# Altium project NB2DSK01.PRJPCB (part 2 of 2)

## Sheet FPGA_PRGSETUP.SchDoc: XC3S1500-4FG676C Configuration
size A4; Organization: Altium Limited.; Address1: Level 3, 12a Rodborough Rd; Address2: Frenchs Forest 2086; Address3: NSW; Address4: AUSTRALIA; DocumentNumber: 13; Revision: 6; SheetNumber: 13; SheetTotal: 64; PageSetup: Record=PageOptions|CenterHorizontal=True|CenterVertical=True|PrintScale=0.97|XCorrection=1.00|YCorrection=1.00|PrintKind=0|BorderSize=5000000|LeftOffset=0|BottomOffset=0|Orientation=2|PaperLength=1000|PaperWidth=1000|Scale=100|PaperSource=7|PrintQuality=-4|MediaType=1|DitherType=10|PaperKind=A4 (210 x 297mm)|PrintScaleMode=1
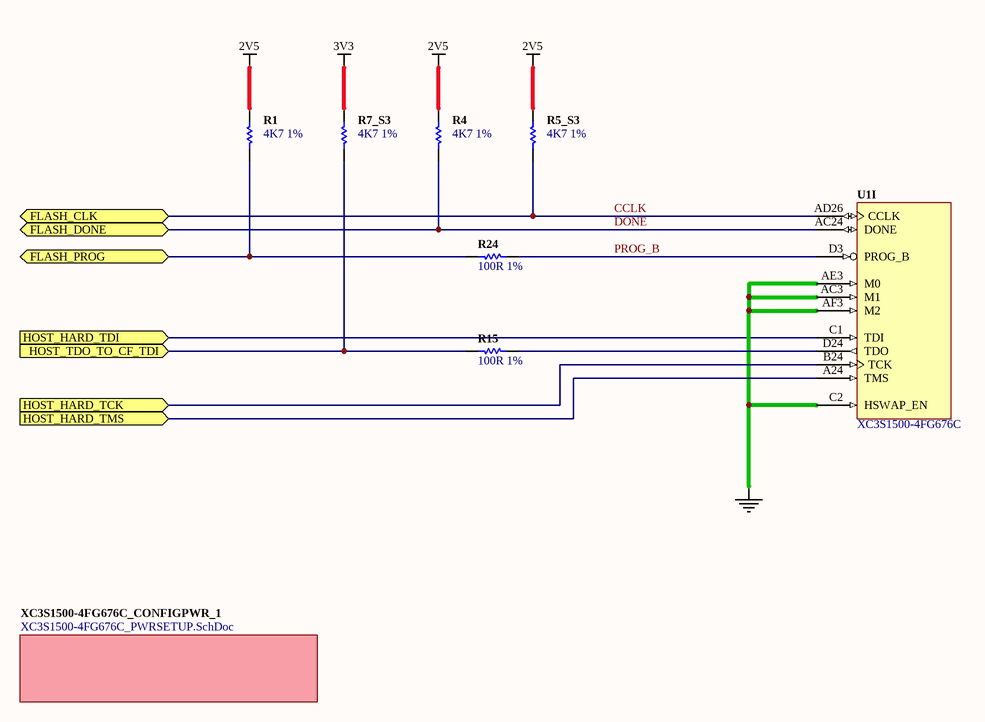
[diagram p6: FPGA_PRGSETUP.SchDoc]

### Parts
(Parts that share a designator on the sheet are numbered #1, #2 ... from top to bottom, then left to right.)
R1  4K7 1%  [RESC1005-STAR]
R4  4K7 1%  [RESC1005-STAR]
R5_S3  4K7 1%  [RESC1005-STAR]
R7_S3  4K7 1%  [RESC1005-STAR]
R15  100R 1%  [RESC1005-STAR]
R24  100R 1%  [RESC1005-STAR]
U1#1  XC3S1500-4FG676C  [BGA100P26X26-676]  (part I of 12)

### Sub-sheets
XC3S1500-4FG676C_CONFIGPWR_1 = XC3S1500-4FG676C_PWRSETUP.SchDoc: no entries

### Ports
FLASH_CLK (bidir), FLASH_DONE (bidir), FLASH_PROG (bidir), HOST_HARD_TCK (in), HOST_HARD_TDI (in), HOST_HARD_TMS (in), HOST_TDO_TO_CF_TDI (in)

### Nets
2V5: R1.1 R4.1 R5_S3.1
3V3: R7_S3.1
GND: U1#1.AC3(M1) U1#1.AE3(M0) U1#1.AF3(M2) U1#1.C2(HSWAP_EN)
CCLK: R5_S3.2 U1#1.AD26(CCLK) ; port FLASH_CLK
DONE: R4.2 U1#1.AC24(DONE) ; port FLASH_DONE
FLASH_PROG: R1.2 R24.2 ; port FLASH_PROG
HOST_HARD_TCK: U1#1.B24(TCK) ; port HOST_HARD_TCK
HOST_HARD_TDI: U1#1.C1(TDI) ; port HOST_HARD_TDI
HOST_HARD_TMS: U1#1.A24(TMS) ; port HOST_HARD_TMS
HOST_TDO_TO_CF_TDI: R7_S3.2 R15.2 ; port HOST_TDO_TO_CF_TDI
PROG_B: R24.1 U1#1.D3(PROG_B)
NetR15_1: R15.1 U1#1.D24(TDO)

### Notes on the sheet
- Sheet Title
- Project Title
- Size:
- Date:
- A4
- Assy:
- Time:
- Sheet
- Revision:
- of
- File:

### Library data of the parts
R1 R4 R5_S3 R7_S3 = D-100-0088: Resistor, 4K7 1% 0402 (1005); Power Rating: 63 mW; Resistance: 4.7 K; Category: Resistor; Mounting Technology: Surface Mount; Status: Production; Tolerance: 1 %
R15 R24 = D-100-0131: Resistor, 100R 1% 0402 (1005); Power Rating: 63 mW; Category: Resistor; Mounting Technology: Surface Mount; Resistance: 100 R; Status: Production; Tolerance: 1 %
U1#1 = D-241-0001: FPGA, Xilinx Spartan3-1500 FG676 Speed=4; EnablePinSwap: True; Supply Voltage: mV; Category: IC-FPGA; Mounting Technology: Surface Mount; Status: Production; Technology: None

## Sheet XC3S1500-4FG676C_PWRSETUP.SchDoc: XC3S1500-4FG676C POWER
size A4; Organization: Altium Limited.; Address1: Level 3, 12a Rodborough Rd; Address2: Frenchs Forest 2086; Address3: NSW; Address4: AUSTRALIA; DocumentNumber: 14; Revision: 6; SheetNumber: 14; SheetTotal: 64; PageSetup: Record=PageOptions|CenterHorizontal=True|CenterVertical=True|PrintScale=0.97|XCorrection=1.00|YCorrection=1.00|PrintKind=0|BorderSize=5000000|LeftOffset=0|BottomOffset=0|Orientation=2|PaperLength=1000|PaperWidth=1000|Scale=100|PaperSource=7|PrintQuality=-4|MediaType=1|DitherType=10|PaperKind=A4 (210 x 297 mm)|PrintScaleMode=1
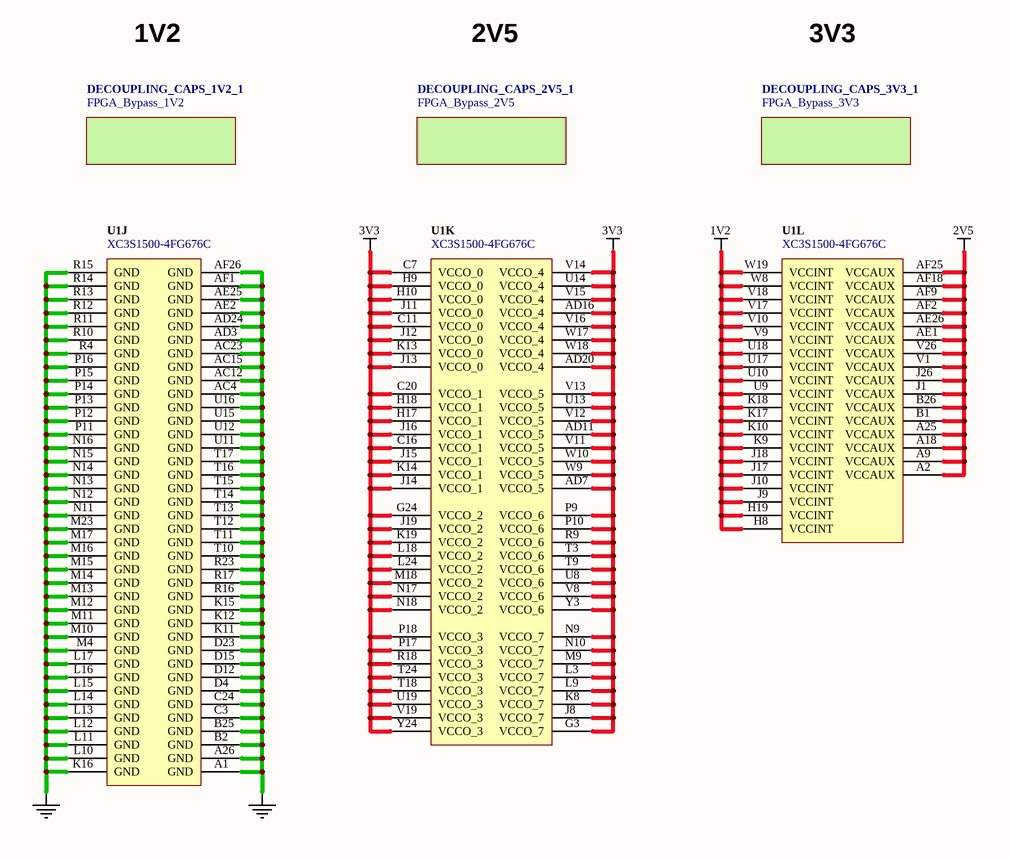
[diagram p7: XC3S1500-4FG676C_PWRSETUP.SchDoc]

### Parts
(Parts that share a designator on the sheet are numbered #1, #2 ... from top to bottom, then left to right.)
U1#1  XC3S1500-4FG676C  [BGA100P26X26-676]  (parts J,K,L of 12)

### Sub-sheets
DECOUPLING_CAPS_1V2_1 = FPGA_Bypass_1V2 (file not in this document): no entries
DECOUPLING_CAPS_2V5_1 = FPGA_Bypass_2V5 (file not in this document): no entries
DECOUPLING_CAPS_3V3_1 = FPGA_Bypass_3V3 (file not in this document): no entries

### Nets
1V2: U1#1.H8(VCCINT) U1#1.H19(VCCINT) U1#1.J9(VCCINT) U1#1.J10(VCCINT) U1#1.J17(VCCINT) U1#1.J18(VCCINT) U1#1.K9(VCCINT) U1#1.K10(VCCINT) U1#1.K17(VCCINT) U1#1.K18(VCCINT) U1#1.U9(VCCINT) U1#1.U10(VCCINT) U1#1.U17(VCCINT) U1#1.U18(VCCINT) U1#1.V9(VCCINT) U1#1.V10(VCCINT) U1#1.V17(VCCINT) U1#1.V18(VCCINT) U1#1.W8(VCCINT) U1#1.W19(VCCINT)
2V5: U1#1.A2(VCCAUX) U1#1.A9(VCCAUX) U1#1.A18(VCCAUX) U1#1.A25(VCCAUX) U1#1.AE1(VCCAUX) U1#1.AE26(VCCAUX) U1#1.AF2(VCCAUX) U1#1.AF9(VCCAUX) U1#1.AF18(VCCAUX) U1#1.AF25(VCCAUX) U1#1.B1(VCCAUX) U1#1.B26(VCCAUX) U1#1.J1(VCCAUX) U1#1.J26(VCCAUX) U1#1.V1(VCCAUX) U1#1.V26(VCCAUX)
3V3: U1#1.AD7(VCCO_5) U1#1.AD11(VCCO_5) U1#1.AD16(VCCO_4) U1#1.AD20(VCCO_4) U1#1.C7(VCCO_0) U1#1.C11(VCCO_0) U1#1.C16(VCCO_1) U1#1.C20(VCCO_1) U1#1.G3(VCCO_7) U1#1.G24(VCCO_2) U1#1.H9(VCCO_0) U1#1.H10(VCCO_0) U1#1.H17(VCCO_1) U1#1.H18(VCCO_1) U1#1.J8(VCCO_7) U1#1.J11(VCCO_0) U1#1.J12(VCCO_0) U1#1.J13(VCCO_0) U1#1.J14(VCCO_1) U1#1.J15(VCCO_1) U1#1.J16(VCCO_1) U1#1.J19(VCCO_2) U1#1.K8(VCCO_7) U1#1.K13(VCCO_0) U1#1.K14(VCCO_1) U1#1.K19(VCCO_2) U1#1.L3(VCCO_7) U1#1.L9(VCCO_7) U1#1.L18(VCCO_2) U1#1.L24(VCCO_2) U1#1.M9(VCCO_7) U1#1.M18(VCCO_2) U1#1.N9(VCCO_7) U1#1.N10(VCCO_7) U1#1.N17(VCCO_2) U1#1.N18(VCCO_2) U1#1.P9(VCCO_6) U1#1.P10(VCCO_6) U1#1.P17(VCCO_3) U1#1.P18(VCCO_3) U1#1.R9(VCCO_6) U1#1.R18(VCCO_3) U1#1.T3(VCCO_6) U1#1.T9(VCCO_6) U1#1.T18(VCCO_3) U1#1.T24(VCCO_3) U1#1.U8(VCCO_6) U1#1.U13(VCCO_5) U1#1.U14(VCCO_4) U1#1.U19(VCCO_3) U1#1.V8(VCCO_6) U1#1.V11(VCCO_5) U1#1.V12(VCCO_5) U1#1.V13(VCCO_5) U1#1.V14(VCCO_4) U1#1.V15(VCCO_4) U1#1.V16(VCCO_4) U1#1.V19(VCCO_3) U1#1.W9(VCCO_5) U1#1.W10(VCCO_5) U1#1.W17(VCCO_4) U1#1.W18(VCCO_4) U1#1.Y3(VCCO_6) U1#1.Y24(VCCO_3)
GND: U1#1.A1(GND) U1#1.A26(GND) U1#1.AC4(GND) U1#1.AC12(GND) U1#1.AC15(GND) U1#1.AC23(GND) U1#1.AD3(GND) U1#1.AD24(GND) U1#1.AE2(GND) U1#1.AE25(GND) U1#1.AF1(GND) U1#1.AF26(GND) U1#1.B2(GND) U1#1.B25(GND) U1#1.C3(GND) U1#1.C24(GND) U1#1.D4(GND) U1#1.D12(GND) U1#1.D15(GND) U1#1.D23(GND) U1#1.K11(GND) U1#1.K12(GND) U1#1.K15(GND) U1#1.K16(GND) U1#1.L10(GND) U1#1.L11(GND) U1#1.L12(GND) U1#1.L13(GND) U1#1.L14(GND) U1#1.L15(GND) U1#1.L16(GND) U1#1.L17(GND) U1#1.M4(GND) U1#1.M10(GND) U1#1.M11(GND) U1#1.M12(GND) U1#1.M13(GND) U1#1.M14(GND) U1#1.M15(GND) U1#1.M16(GND) U1#1.M17(GND) U1#1.M23(GND) U1#1.N11(GND) U1#1.N12(GND) U1#1.N13(GND) U1#1.N14(GND) U1#1.N15(GND) U1#1.N16(GND) U1#1.P11(GND) U1#1.P12(GND) U1#1.P13(GND) U1#1.P14(GND) U1#1.P15(GND) U1#1.P16(GND) U1#1.R4(GND) U1#1.R10(GND) U1#1.R11(GND) U1#1.R12(GND) U1#1.R13(GND) U1#1.R14(GND) U1#1.R15(GND) U1#1.R16(GND) U1#1.R17(GND) U1#1.R23(GND) U1#1.T10(GND) U1#1.T11(GND) U1#1.T12(GND) U1#1.T13(GND) U1#1.T14(GND) U1#1.T15(GND) U1#1.T16(GND) U1#1.T17(GND) U1#1.U11(GND) U1#1.U12(GND) U1#1.U15(GND) U1#1.U16(GND)

### Notes on the sheet
- 1V2
- 2V5
- 3V3
- Sheet Title
- Project Title
- Size:
- Date:
- A4
- Assy:
- Time:
- Sheet
- Revision:
- of
- File:

### Library data of the parts
U1#1 = D-241-0001: FPGA, Xilinx Spartan3-1500 FG676 Speed=4; Supply Voltage: mV; Category: IC-FPGA; Mounting Technology: Surface Mount; Status: Production; Technology: None

## Sheet CURRENT_SENSE.SchDoc: DB/PB Current Sense
size A3
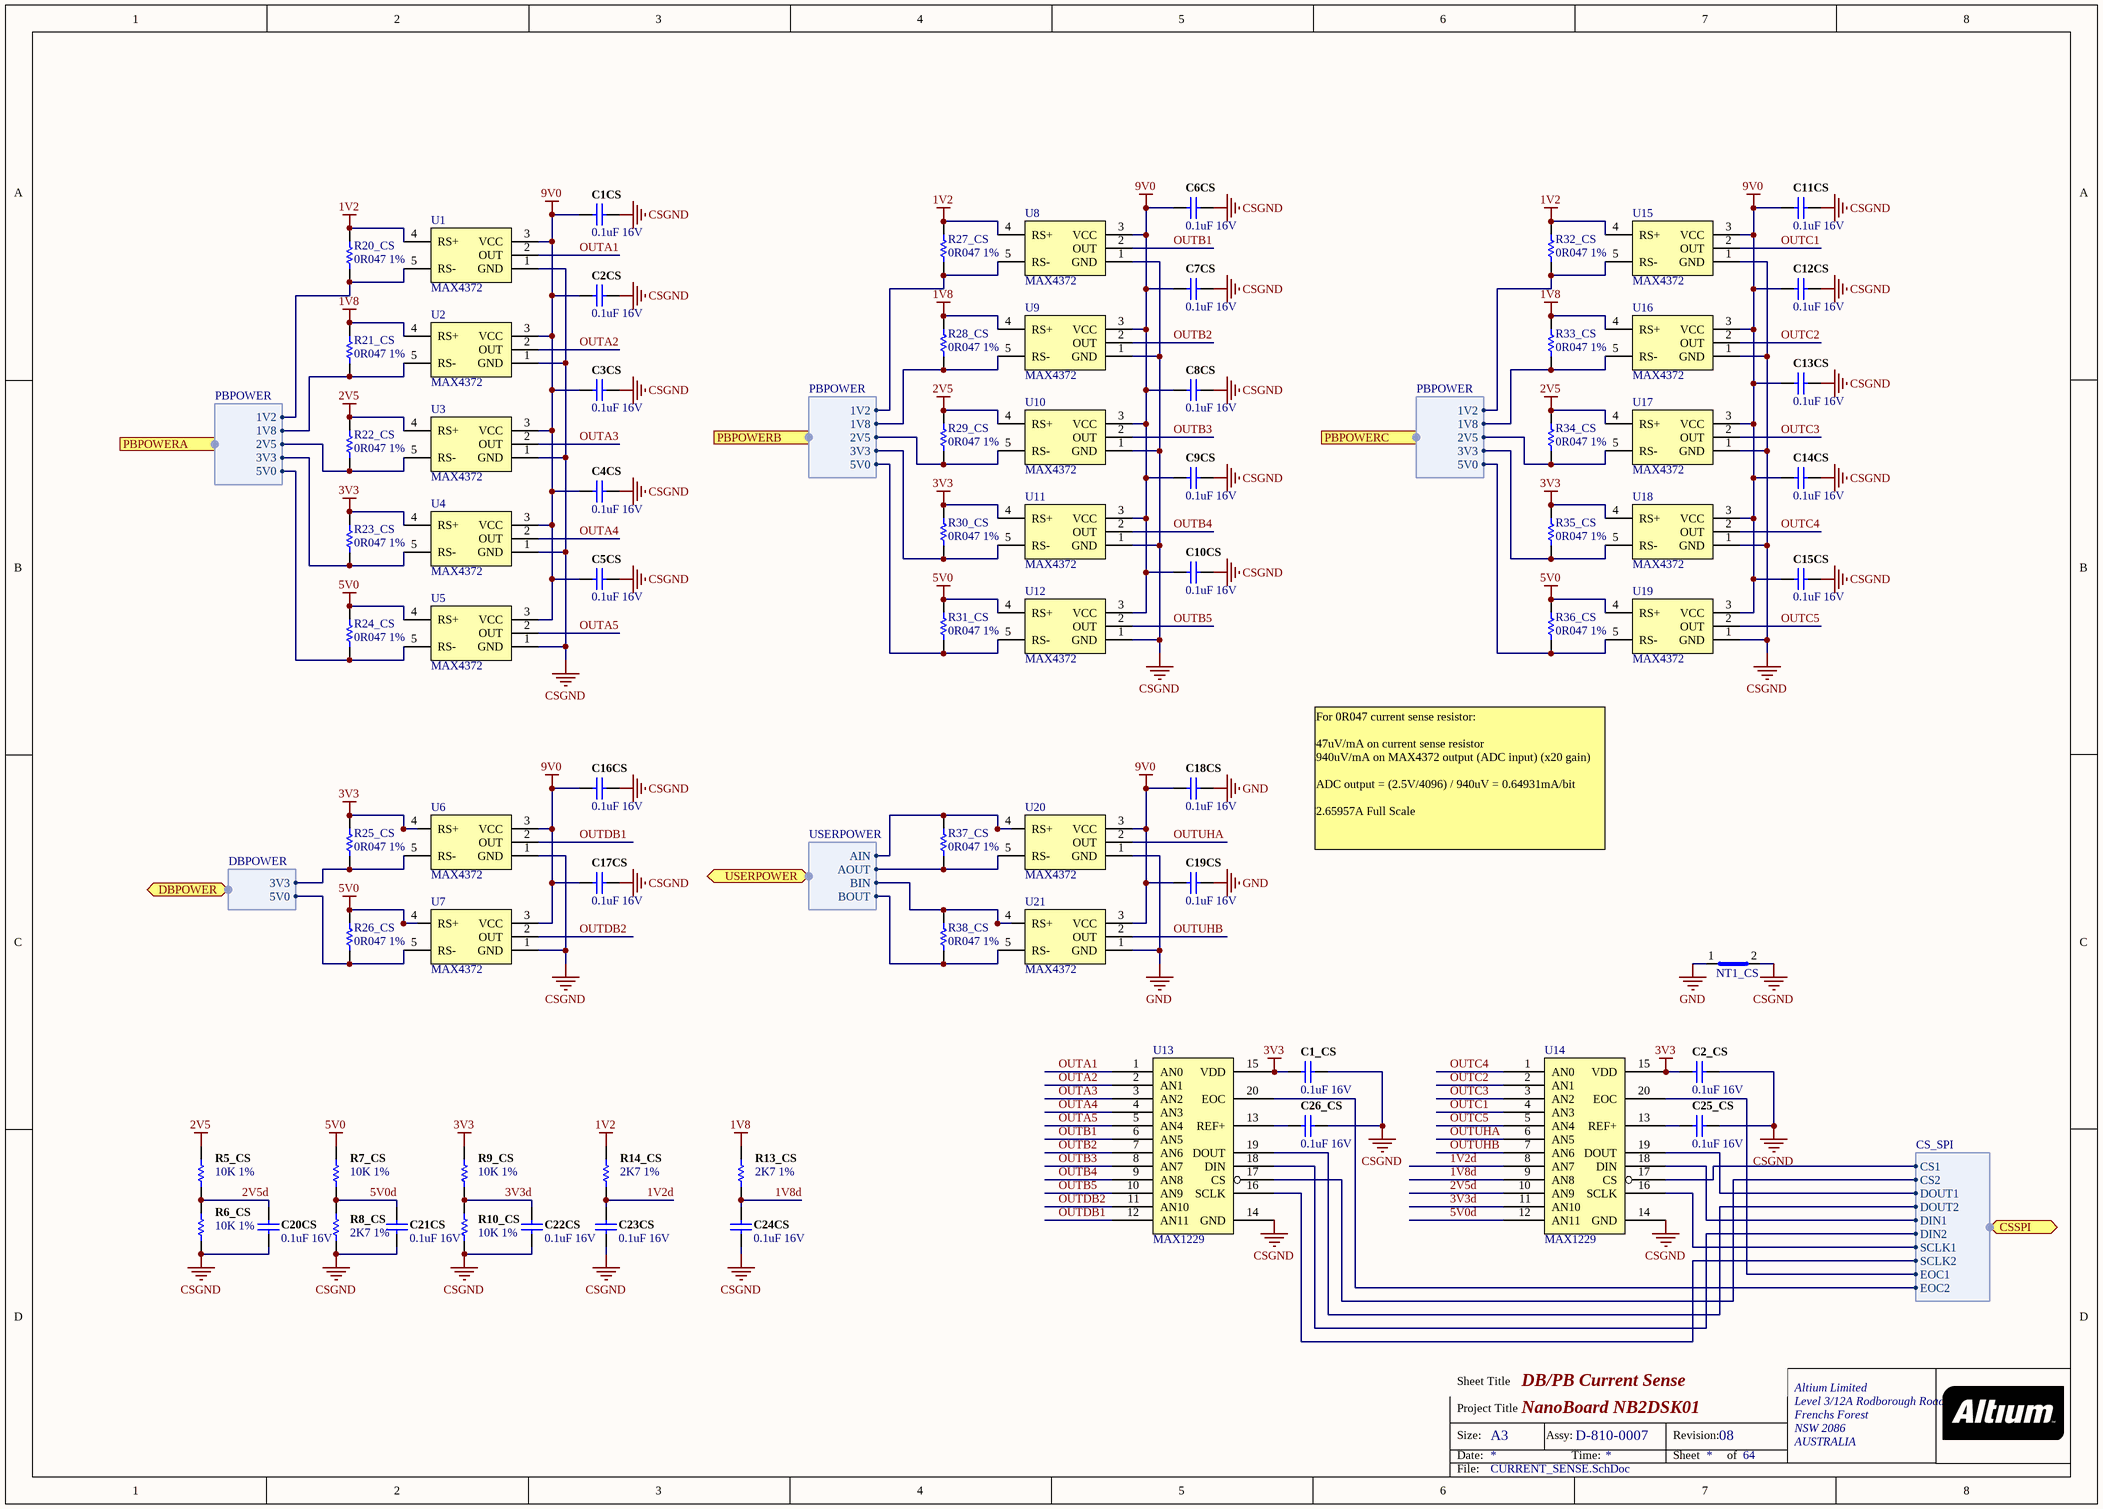
[diagram p8: CURRENT_SENSE.SchDoc]

### Parts
(Parts that share a designator on the sheet are numbered #1, #2 ... from top to bottom, then left to right.)
C1_CS  0.1uF 16V  [CAPC1005-STAR]
C1CS  0.1uF 16V  [CAPC1005-STAR]
C2_CS  0.1uF 16V  [CAPC1005-STAR]
C2CS  0.1uF 16V  [CAPC1005-STAR]
C3CS  0.1uF 16V  [CAPC1005-STAR]
C4CS  0.1uF 16V  [CAPC1005-STAR]
C5CS  0.1uF 16V  [CAPC1005-STAR]
C6CS  0.1uF 16V  [CAPC1005-STAR]
C7CS  0.1uF 16V  [CAPC1005-STAR]
C8CS  0.1uF 16V  [CAPC1005-STAR]
C9CS  0.1uF 16V  [CAPC1005-STAR]
C10CS  0.1uF 16V  [CAPC1005-STAR]
C11CS  0.1uF 16V  [CAPC1005-STAR]
C12CS  0.1uF 16V  [CAPC1005-STAR]
C13CS  0.1uF 16V  [CAPC1005-STAR]
C14CS  0.1uF 16V  [CAPC1005-STAR]
C15CS  0.1uF 16V  [CAPC1005-STAR]
C16CS  0.1uF 16V  [CAPC1005-STAR]
C17CS  0.1uF 16V  [CAPC1005-STAR]
C18CS  0.1uF 16V  [CAPC1005-STAR]
C19CS  0.1uF 16V  [CAPC1005-STAR]
C20CS  0.1uF 16V  [CAPC1005-STAR]
C21CS  0.1uF 16V  [CAPC1005-STAR]
C22CS  0.1uF 16V  [CAPC1005-STAR]
C23CS  0.1uF 16V  [CAPC1005-STAR]
C24CS  0.1uF 16V  [CAPC1005-STAR]
C25_CS  0.1uF 16V  [CAPC1005-STAR]
C26_CS  0.1uF 16V  [CAPC1005-STAR]
NT1_CS  Net Tie SMT2  [NETTIE-SMT2-8X8]  (value not drawn)  (net tie, no BOM)
R5_CS  10K 1%  [RESC1005-STAR]
R6_CS  10K 1%  [RESC1005-STAR]
R7_CS  10K 1%  [RESC1005-STAR]
R8_CS  2K7 1%  [RESC1005-STAR]
R9_CS  10K 1%  [RESC1005-STAR]
R10_CS  10K 1%  [RESC1005-STAR]
R13_CS  2K7 1%  [RESC1005-STAR]
R14_CS  2K7 1%  [RESC1005-STAR]
R20_CS  0R047 1%  [RESC3216]
R21_CS  0R047 1%  [RESC3216]
R22_CS  0R047 1%  [RESC3216]
R23_CS  0R047 1%  [RESC3216]
R24_CS  0R047 1%  [RESC3216]
R25_CS  0R047 1%  [RESC3216]
R26_CS  0R047 1%  [RESC3216]
R27_CS  0R047 1%  [RESC3216]
R28_CS  0R047 1%  [RESC3216]
R29_CS  0R047 1%  [RESC3216]
R30_CS  0R047 1%  [RESC3216]
R31_CS  0R047 1%  [RESC3216]
R32_CS  0R047 1%  [RESC3216]
R33_CS  0R047 1%  [RESC3216]
R34_CS  0R047 1%  [RESC3216]
R35_CS  0R047 1%  [RESC3216]
R36_CS  0R047 1%  [RESC3216]
R37_CS  0R047 1%  [RESC3216]
R38_CS  0R047 1%  [RESC3216]
U1#2  MAX4372  [SOT-23-5]
U2  MAX4372  [SOT-23-5]
U3  MAX4372  [SOT-23-5]
U4  MAX4372  [SOT-23-5]
U5  MAX4372  [SOT-23-5]
U6  MAX4372  [SOT-23-5]
U7  MAX4372  [SOT-23-5]
U8  MAX4372  [SOT-23-5]
U9  MAX4372  [SOT-23-5]
U10  MAX4372  [SOT-23-5]
U11  MAX4372  [SOT-23-5]
U12  MAX4372  [SOT-23-5]
U13  MAX1229  [QSOP65P600-20]
U14  MAX1229  [QSOP65P600-20]
U15  MAX4372  [SOT-23-5]
U16  MAX4372  [SOT-23-5]
U17  MAX4372  [SOT-23-5]
U18  MAX4372  [SOT-23-5]
U19  MAX4372  [SOT-23-5]
U20  MAX4372  [SOT-23-5]
U21  MAX4372  [SOT-23-5]

### Ports
CSSPI (harness CS_SPI), DBPOWER (harness DBPOWER), PBPOWERA (harness PBPOWER), PBPOWERB (harness PBPOWER), PBPOWERC (harness PBPOWER), USERPOWER (harness USERPOWER)

### Harnesses
PBPOWER: 1V2, 1V8, 2V5, 3V3, 5V0
DBPOWER: 3V3, 5V0
USERPOWER: AIN, BIN, AOUT, BOUT
CS_SPI: CS2, DOUT1, DOUT2, DIN1, CS1, DIN2, SCLK1, EOC1, SCLK2, EOC2

### Nets
1V2: R14_CS.2 R20_CS.1 R27_CS.1 R32_CS.1 U1#2.4(RS+) U8.4(RS+) U15.4(RS+)
1V8: R13_CS.2 R21_CS.1 R28_CS.1 R33_CS.1 U2.4(RS+) U9.4(RS+) U16.4(RS+)
2V5: R5_CS.2 R22_CS.1 R29_CS.1 R34_CS.1 U3.4(RS+) U10.4(RS+) U17.4(RS+)
3V3: C1_CS.1 C2_CS.1 R9_CS.2 R23_CS.1 R25_CS.1 R30_CS.1 R35_CS.1 U4.4(RS+) U6.4(RS+) U11.4(RS+) U13.15(VDD) U14.15(VDD) U18.4(RS+)
5V0: R7_CS.2 R24_CS.1 R26_CS.1 R31_CS.1 R36_CS.1 U5.4(RS+) U7.4(RS+) U12.4(RS+) U19.4(RS+)
9V0: C1CS.1 C2CS.1 C3CS.1 C4CS.1 C5CS.1 C6CS.1 C7CS.1 C8CS.1 C9CS.1 C10CS.1 C11CS.1 C12CS.1 C13CS.1 C14CS.1 C15CS.1 C16CS.1 C17CS.1 C18CS.1 C19CS.1 U1#2.3(VCC) U2.3(VCC) U3.3(VCC) U4.3(VCC) U5.3(VCC) U6.3(VCC) U7.3(VCC) U8.3(VCC) U9.3(VCC) U10.3(VCC) U11.3(VCC) U12.3(VCC) U15.3(VCC) U16.3(VCC) U17.3(VCC) U18.3(VCC) U19.3(VCC) U20.3(VCC) U21.3(VCC)
CSGND: C1_CS.2 C1CS.2 C2_CS.2 C2CS.2 C3CS.2 C4CS.2 C5CS.2 C6CS.2 C7CS.2 C8CS.2 C9CS.2 C10CS.2 C11CS.2 C12CS.2 C13CS.2 C14CS.2 C15CS.2 C16CS.2 C17CS.2 C20CS.1 C21CS.1 C22CS.1 C23CS.1 C24CS.1 C25_CS.2 C26_CS.2 NT1_CS.2(Net2) R6_CS.1 R8_CS.1 R10_CS.1 U1#2.1(GND) U2.1(GND) U3.1(GND) U4.1(GND) U5.1(GND) U6.1(GND) U7.1(GND) U8.1(GND) U9.1(GND) U10.1(GND) U11.1(GND) U12.1(GND) U13.14(GND) U14.14(GND) U15.1(GND) U16.1(GND) U17.1(GND) U18.1(GND) U19.1(GND)
GND: C18CS.2 C19CS.2 NT1_CS.1(Net1) U20.1(GND) U21.1(GND)
1V2d: C23CS.2 R14_CS.1 U14.8(AN7)
1V8d: C24CS.2 R13_CS.1 U14.9(AN8)
2V5d: C20CS.2 R5_CS.1 R6_CS.2 U14.10(AN9)
3V3d: C22CS.2 R9_CS.1 R10_CS.2 U14.11(AN10)
5V0d: C21CS.2 R7_CS.1 R8_CS.2 U14.12(AN11)
CSSPI_CS1: U14.17(CS) ; port CSSPI.CS1
CSSPI_CS2: U13.17(CS) ; port CSSPI.CS2
CSSPI_DIN: U14.18(DIN) ; port CSSPI.DIN1
CSSPI_DIN2: U13.18(DIN) ; port CSSPI.DIN2
CSSPI_DOUT: U14.19(DOUT) ; port CSSPI.DOUT1
CSSPI_DOUT2: U13.19(DOUT) ; port CSSPI.DOUT2
CSSPI_EOC1: U14.20(EOC) ; port CSSPI.EOC1
CSSPI_EOC2: U13.20(EOC) ; port CSSPI.EOC2
CSSPI_SCLK: U14.16(SCLK) ; port CSSPI.SCLK1
CSSPI_SCLK2: U13.16(SCLK) ; port CSSPI.SCLK2
OUTA1: U1#2.2(OUT) U13.1(AN0)
OUTA2: U2.2(OUT) U13.2(AN1)
OUTA3: U3.2(OUT) U13.3(AN2)
OUTA4: U4.2(OUT) U13.4(AN3)
OUTA5: U5.2(OUT) U13.5(AN4)
OUTB1: U8.2(OUT) U13.6(AN5)
OUTB2: U9.2(OUT) U13.7(AN6)
OUTB3: U10.2(OUT) U13.8(AN7)
OUTB4: U11.2(OUT) U13.9(AN8)
OUTB5: U12.2(OUT) U13.10(AN9)
OUTC1: U14.4(AN3) U15.2(OUT)
OUTC2: U14.2(AN1) U16.2(OUT)
OUTC3: U14.3(AN2) U17.2(OUT)
OUTC4: U14.1(AN0) U18.2(OUT)
OUTC5: U14.5(AN4) U19.2(OUT)
OUTDB1: U6.2(OUT) U13.12(AN11)
OUTDB2: U7.2(OUT) U13.11(AN10)
OUTUHA: U14.6(AN5) U20.2(OUT)
OUTUHB: U14.7(AN6) U21.2(OUT)
NetC25_CS_1: C25_CS.1 U14.13(REF+)
NetC26_CS_1: C26_CS.1 U13.13(REF+)
NetR20_CS_2: R20_CS.2 U1#2.5(RS-) ; port PBPOWERA.1V2
NetR21_CS_2: R21_CS.2 U2.5(RS-) ; port PBPOWERA.1V8
NetR22_CS_2: R22_CS.2 U3.5(RS-) ; port PBPOWERA.2V5
NetR23_CS_2: R23_CS.2 U4.5(RS-) ; port PBPOWERA.3V3
NetR24_CS_2: R24_CS.2 U5.5(RS-) ; port PBPOWERA.5V0
NetR25_CS_2: R25_CS.2 U6.5(RS-) ; port DBPOWER.3V3
NetR26_CS_2: R26_CS.2 U7.5(RS-) ; port DBPOWER.5V0
NetR27_CS_2: R27_CS.2 U8.5(RS-) ; port PBPOWERB.1V2
NetR28_CS_2: R28_CS.2 U9.5(RS-) ; port PBPOWERB.1V8
NetR29_CS_2: R29_CS.2 U10.5(RS-) ; port PBPOWERB.2V5
NetR30_CS_2: R30_CS.2 U11.5(RS-) ; port PBPOWERB.3V3
NetR31_CS_2: R31_CS.2 U12.5(RS-) ; port PBPOWERB.5V0
NetR32_CS_2: R32_CS.2 U15.5(RS-) ; port PBPOWERC.1V2
NetR33_CS_2: R33_CS.2 U16.5(RS-) ; port PBPOWERC.1V8
NetR34_CS_2: R34_CS.2 U17.5(RS-) ; port PBPOWERC.2V5
NetR35_CS_2: R35_CS.2 U18.5(RS-) ; port PBPOWERC.3V3
NetR36_CS_2: R36_CS.2 U19.5(RS-) ; port PBPOWERC.5V0
NetR37_CS_1: R37_CS.1 U20.4(RS+) ; port USERPOWER.AIN
NetR37_CS_2: R37_CS.2 U20.5(RS-) ; port USERPOWER.AOUT
NetR38_CS_1: R38_CS.1 U21.4(RS+) ; port USERPOWER.BIN
NetR38_CS_2: R38_CS.2 U21.5(RS-) ; port USERPOWER.BOUT

### Notes on the sheet
- For 0R047 current sense resistor:
  47uV/mA on current sense resistor
  940uV/mA on MAX4372 output (ADC input) (x20 gain)
  ADC output = (2.5V/4096) / 940uV = 0.64931mA/bit
  2.65957A Full Scale
- Sheet Title
- Project Title
- Size:
- Date:
- A3
- Assy:
- Time:
- Revision:
- Sheet
- of
- File:

### Library data of the parts
C1_CS C1CS C2_CS C2CS C3CS C4CS C5CS C6CS C7CS C8CS C9CS C10CS C11CS C12CS C13CS C14CS C15CS C16CS C17CS C18CS C19CS C20CS C21CS C22CS C23CS C24CS C25_CS C26_CS = D-101-0080: Capacitor, Ceramic, 0.1uF 10% 16V 0402 (1005) X7R; Polarity: Non-Polarized; Category: Capacitor; Capacitance: 0.1 uF; Dielectric: X7R; Mounting Technology: Surface Mount; Rated Voltage: 16 V; Status: Production; Technology: Ceramic; Tolerance: 10 %
NT1_CS = D-002-0002: Net-Tie, Surface Mount, 2 x 0.4mm x 0.2mm SMT Pads - For 0.2mm Track; Status: Production; Category: Net-Tie
R5_CS R6_CS R7_CS R9_CS R10_CS = D-100-0130: Resistor, 10K 1% 0402 (1005); Power Rating: 63 mW; Category: Resistor; Mounting Technology: Surface Mount; Resistance: 10 K; Status: Production; Tolerance: 1 %
R8_CS R13_CS R14_CS = D-100-0105: Resistor, 2K7 1% 0402 (1005); Power Rating: 63 mW; Resistance: 2.7 K; Category: Resistor; Mounting Technology: Surface Mount; Status: Production; Tolerance: 1 %
R20_CS R21_CS R22_CS R23_CS R24_CS R25_CS R26_CS R27_CS R28_CS R29_CS R30_CS R31_CS R32_CS R33_CS R34_CS R35_CS R36_CS R37_CS R38_CS = D-100-0007: Resistor, 0R047, LRC02P, SMD, 1206, Thick Film, Current Sense, 1%; Power Rating: mW; Resistance: 47 mR; Mounting Technology: Surface Mount; Status: Production; Tolerance: 1 %; Category: Resistor
U1#2 U2-U12 U15-U21 = D-204-0012: MAX4372 High Side Current Sense Amplifier; Max Input Voltage: mV; Max Output Current: mA; Max Output Voltage: mV; Min Input Voltage: mV; Min Output Voltage: mV; Mounting Technology: Surface Mount; Status: Production; Supply Voltage: mV; Category: IC-Power
U13 U14 = D-220-0003: MAX1229, 12bit ADC, 12 channel, 3.3V, SPI; Bit Width: 12 Bits; Max Sample Frequency: Hz; Digital Interface: SPI; Mounting Technology: Surface Mount; Status: Production; Supply Voltage: 3.3 V; Category: IC-ADC

## Sheet NB2_DB.SchDoc
size A3
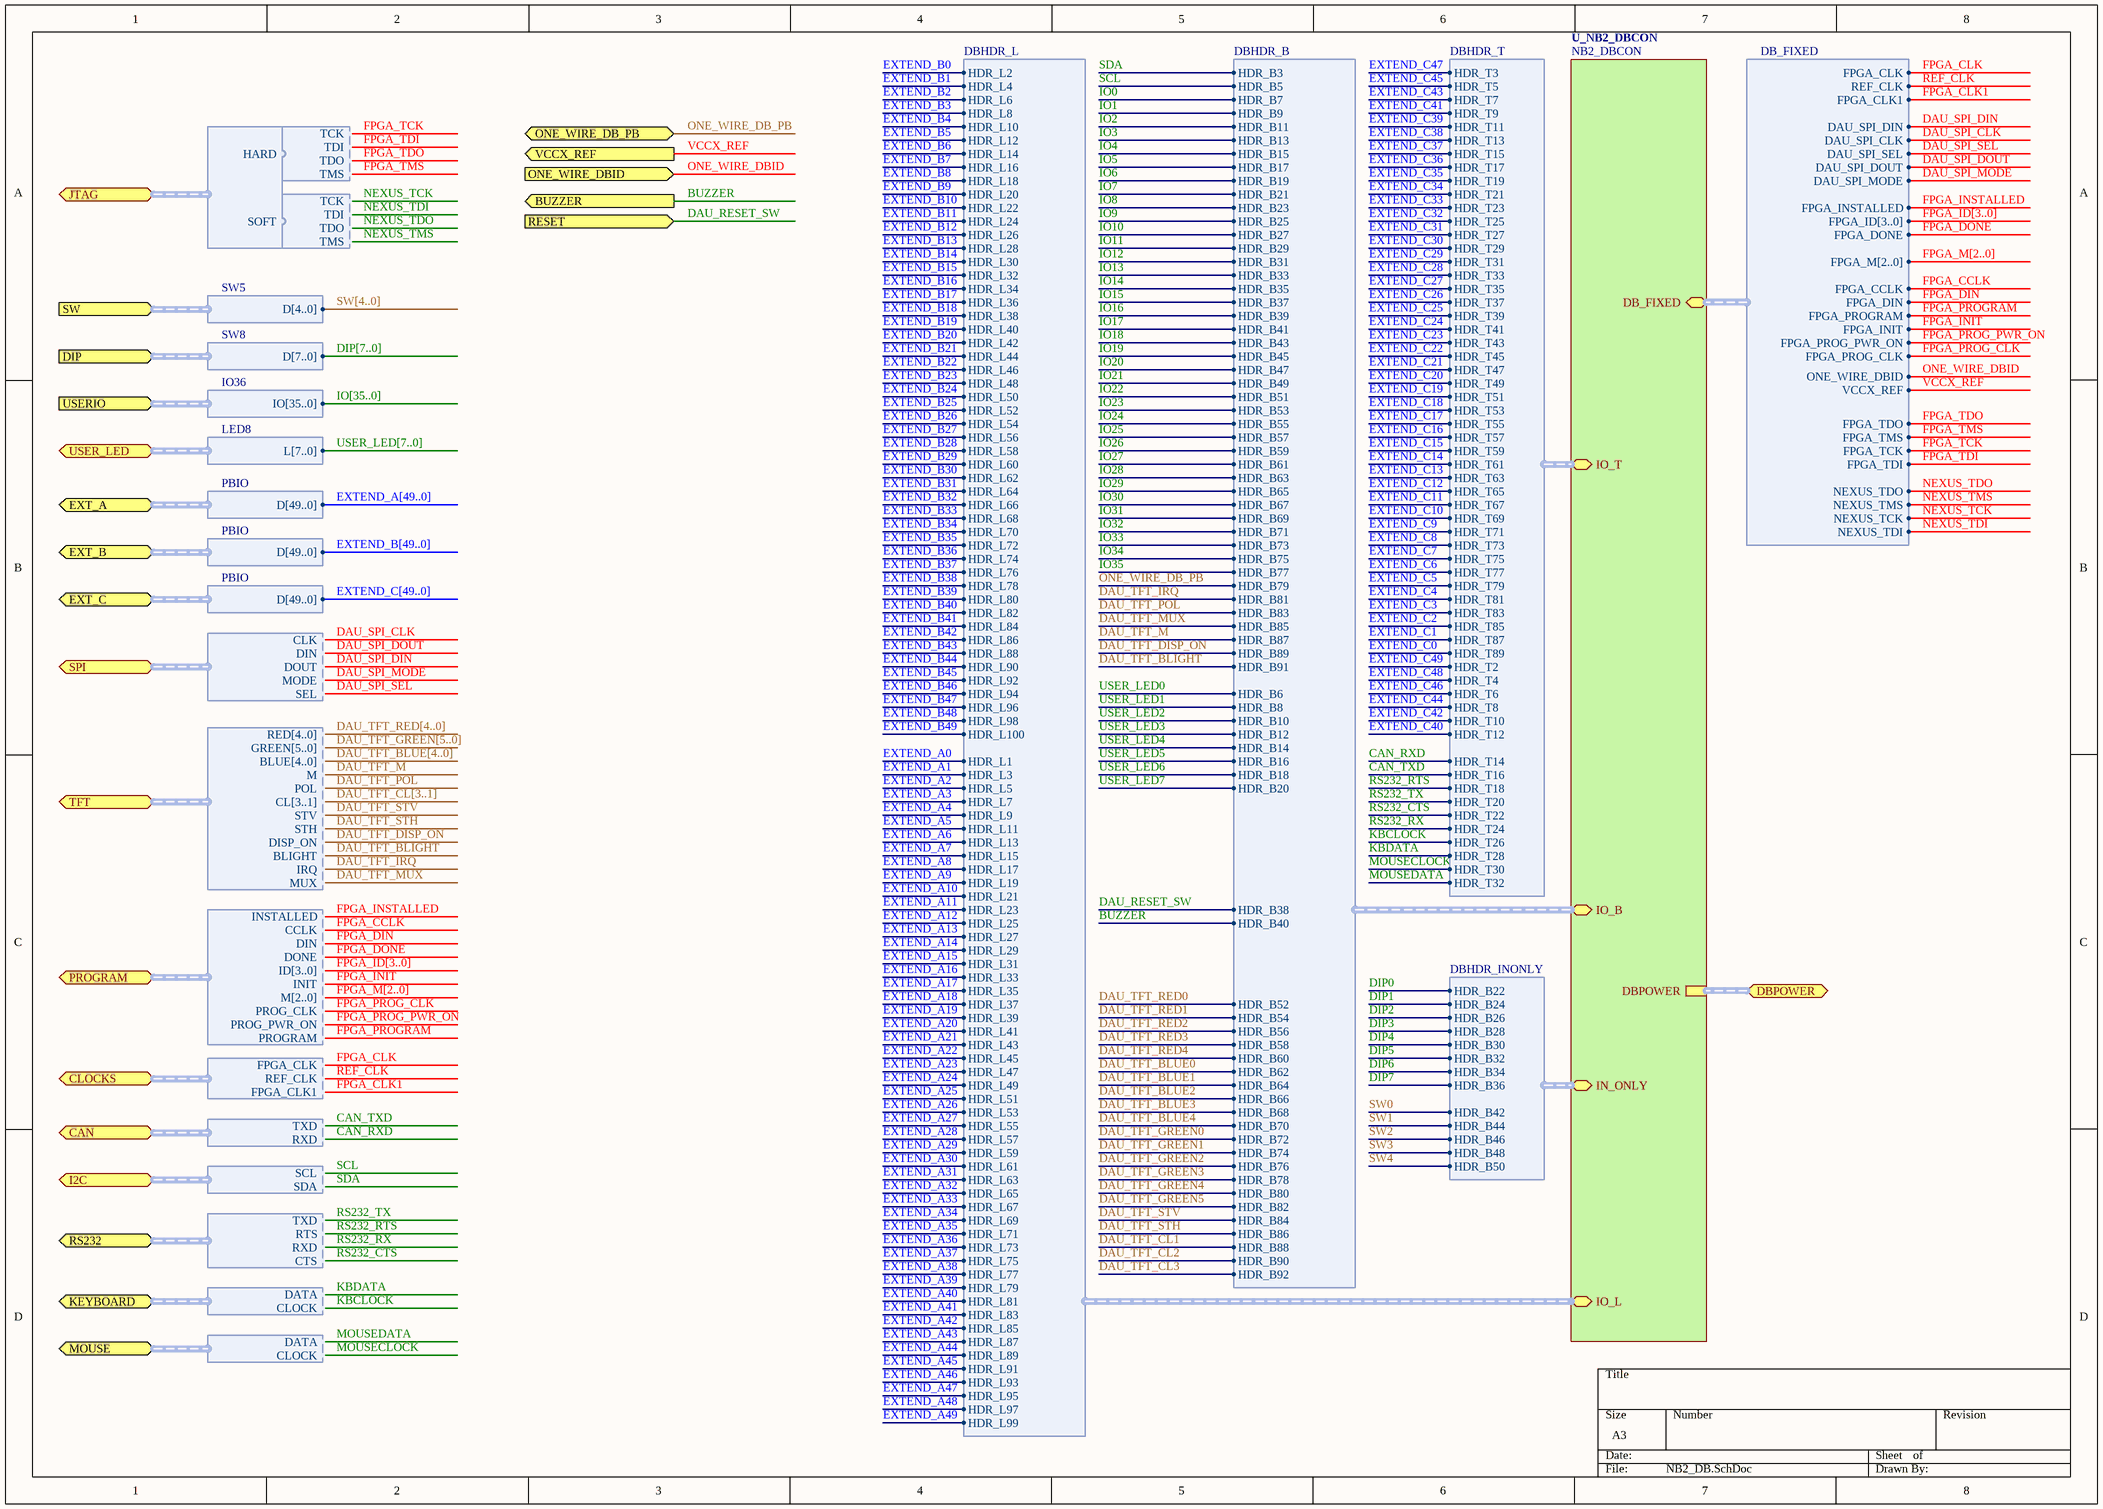
[diagram p9: NB2_DB.SchDoc]

### Sub-sheets
U_NB2_DBCON = NB2_DBCON (file not in this document): DBPOWER (harness DBPOWER), IO_B (harness DBHDR_B), DB_FIXED (harness DB_FIXED), IO_T (harness DBHDR_T), IN_ONLY (harness DBHDR_INONLY), IO_L (harness DBHDR_L)

### Ports
BUZZER (out), CAN (harness CAN_INT), CLOCKS (harness DAU_CLK), DBPOWER, DIP (harness SW8), EXT_A (harness PBIO), EXT_B (harness PBIO), EXT_C (harness PBIO), I2C (harness I2C), JTAG (harness HardSoft_JTAG), KEYBOARD (harness PS2), MOUSE (harness PS2), ONE_WIRE_DB_PB (bidir), ONE_WIRE_DBID (in), PROGRAM (harness DAU_CTRL), RESET (in), RS232 (harness RS232_INT), SPI (harness DAU_SPI), SW (harness SW5), TFT (harness DAU_TFT), USER_LED (harness LED8), USERIO (harness IO36), VCCX_REF (out)

### Harnesses
JTAG: TMS, TDO, TDI, TCK
HardSoft_JTAG: HARD, SOFT
LED8: L[7..0]
IO36: IO[35..0]
SW8: D[7..0]
SW5: D[4..0]
PBIO: D[49..0]
DAU_CLK: REF_CLK, FPGA_CLK, FPGA_CLK1
DAU_SPI: MODE, SEL, CLK, DIN, DOUT
DAU_CTRL: DIN, DONE, INSTALLED, ID[3..0], CCLK, PROGRAM, M[2..0], INIT, PROG_PWR_ON, PROG_CLK
DAU_TFT: RED[4..0], GREEN[5..0], BLUE[4..0], M, POL, CL[3..1], STV, STH, DISP_ON, BLIGHT, IRQ, MUX
PS2: DATA, CLOCK
CAN_INT: TXD, RXD
I2C: SCL, SDA
RS232_INT: RXD, TXD, RTS, CTS
DBHDR_B: HDR_B3, HDR_B5, HDR_B7, HDR_B9, HDR_B11, HDR_B13, HDR_B15, HDR_B17, HDR_B19, HDR_B21, HDR_B23, HDR_B25, HDR_B27, HDR_B29, HDR_B31, HDR_B33, HDR_B35, HDR_B37, HDR_B39, HDR_B41, HDR_B43, HDR_B45, HDR_B47, HDR_B49, HDR_B51, HDR_B53, HDR_B55, HDR_B57, HDR_B59, HDR_B61, HDR_B63, HDR_B65, HDR_B67, HDR_B69, HDR_B71, HDR_B73, HDR_B75, HDR_B77, HDR_B79, HDR_B81, HDR_B83, HDR_B85, HDR_B87, HDR_B89, HDR_B91, HDR_B6, HDR_B8, HDR_B10, HDR_B12, HDR_B14, HDR_B16, HDR_B18, HDR_B20, HDR_B38, HDR_B40, HDR_B52, HDR_B54, HDR_B56, HDR_B58, HDR_B60, HDR_B62, HDR_B64, HDR_B66, HDR_B68, HDR_B70, HDR_B72, HDR_B74, HDR_B76, HDR_B78, HDR_B80, HDR_B82, HDR_B84, HDR_B86, HDR_B88, HDR_B90, HDR_B92
DBHDR_T: HDR_T3, HDR_T5, HDR_T7, HDR_T9, HDR_T11, HDR_T13, HDR_T15, HDR_T17, HDR_T19, HDR_T21, HDR_T23, HDR_T25, HDR_T27, HDR_T29, HDR_T31, HDR_T33, HDR_T35, HDR_T37, HDR_T39, HDR_T41, HDR_T43, HDR_T45, HDR_T47, HDR_T49, HDR_T51, HDR_T53, HDR_T55, HDR_T57, HDR_T59, HDR_T61, HDR_T63, HDR_T65, HDR_T67, HDR_T69, HDR_T71, HDR_T73, HDR_T75, HDR_T77, HDR_T79, HDR_T81, HDR_T83, HDR_T85, HDR_T87, HDR_T89, HDR_T2, HDR_T4, HDR_T6, HDR_T8, HDR_T10, HDR_T12, HDR_T14, HDR_T16, HDR_T18, HDR_T20, HDR_T22, HDR_T24, HDR_T26, HDR_T28, HDR_T30, HDR_T32
DBHDR_L: HDR_L2, HDR_L4, HDR_L6, HDR_L8, HDR_L10, HDR_L12, HDR_L14, HDR_L16, HDR_L18, HDR_L20, HDR_L22, HDR_L24, HDR_L26, HDR_L28, HDR_L30, HDR_L32, HDR_L34, HDR_L36, HDR_L38, HDR_L40, HDR_L42, HDR_L44, HDR_L46, HDR_L48, HDR_L50, HDR_L52, HDR_L54, HDR_L56, HDR_L58, HDR_L60, HDR_L62, HDR_L64, HDR_L66, HDR_L68, HDR_L70, HDR_L72, HDR_L74, HDR_L76, HDR_L78, HDR_L80, HDR_L82, HDR_L84, HDR_L86, HDR_L88, HDR_L90, HDR_L92, HDR_L94, HDR_L96, HDR_L98, HDR_L100, HDR_L1, HDR_L3, HDR_L5, HDR_L7, HDR_L9, HDR_L11, HDR_L13, HDR_L15, HDR_L17, HDR_L19, HDR_L21, HDR_L23, HDR_L25, HDR_L27, HDR_L29, HDR_L31, HDR_L33, HDR_L35, HDR_L37, HDR_L39, HDR_L41, HDR_L43, HDR_L45, HDR_L47, HDR_L49, HDR_L51, HDR_L53, HDR_L55, HDR_L57, HDR_L59, HDR_L61, HDR_L63, HDR_L65, HDR_L67, HDR_L69, HDR_L71, HDR_L73, HDR_L75, HDR_L77, HDR_L79, HDR_L81, HDR_L83, HDR_L85, HDR_L87, HDR_L89, HDR_L91, HDR_L93, HDR_L95, HDR_L97, HDR_L99
DBHDR_INONLY: HDR_B22, HDR_B24, HDR_B26, HDR_B28, HDR_B30, HDR_B32, HDR_B34, HDR_B36, HDR_B42, HDR_B44, HDR_B46, HDR_B48, HDR_B50
DB_FIXED: DAU_SPI_CLK, DAU_SPI_DIN, DAU_SPI_DOUT, NEXUS_TMS, NEXUS_TDI, NEXUS_TDO, NEXUS_TCK, ONE_WIRE_DBID, FPGA_INSTALLED, FPGA_PROG_CLK, DAU_SPI_SEL, DAU_SPI_MODE, FPGA_PROG_PWR_ON, FPGA_DONE, FPGA_CCLK, FPGA_PROGRAM, FPGA_DIN, FPGA_INIT, FPGA_TDO, FPGA_TDI, FPGA_TCK, FPGA_TMS, FPGA_CLK1, FPGA_ID[3..0], FPGA_M[2..0], VCCX_REF, FPGA_CLK, REF_CLK

### Nets
BUZZER: port BUZZER, sheet U_NB2_DBCON/IO_B.HDR_B40
CAN_RXD: port CAN.RXD, sheet U_NB2_DBCON/IO_T.HDR_T14  [project net CAN.RXD]
CAN_TXD: port CAN.TXD, sheet U_NB2_DBCON/IO_T.HDR_T16  [project net CAN.TXD]
DAU_RESET_SW: port RESET, sheet U_NB2_DBCON/IO_B.HDR_B38
DAU_SPI_CLK: port SPI.CLK, sheet U_NB2_DBCON/DB_FIXED.DAU_SPI_CLK  [project net DAU_SPI.CLK]
DAU_SPI_DIN: port SPI.DOUT, sheet U_NB2_DBCON/DB_FIXED.DAU_SPI_DIN  [project net DAU_SPI.DOUT]
DAU_SPI_DOUT: port SPI.DIN, sheet U_NB2_DBCON/DB_FIXED.DAU_SPI_DOUT  [project net DAU_SPI.DIN]
DAU_SPI_MODE: port SPI.MODE, sheet U_NB2_DBCON/DB_FIXED.DAU_SPI_MODE  [project net DAU_SPI.MODE]
DAU_SPI_SEL: port SPI.SEL, sheet U_NB2_DBCON/DB_FIXED.DAU_SPI_SEL  [project net DAU_SPI.SEL]
DAU_TFT_BLIGHT: port TFT.BLIGHT, sheet U_NB2_DBCON/IO_B.HDR_B91  [project net DAU_TFT.BLIGHT]
DAU_TFT_BLUE0: sheet U_NB2_DBCON/IO_B.HDR_B62
DAU_TFT_BLUE1: sheet U_NB2_DBCON/IO_B.HDR_B64
DAU_TFT_BLUE2: sheet U_NB2_DBCON/IO_B.HDR_B66
DAU_TFT_BLUE3: sheet U_NB2_DBCON/IO_B.HDR_B68
DAU_TFT_BLUE4: sheet U_NB2_DBCON/IO_B.HDR_B70
DAU_TFT_CL1: sheet U_NB2_DBCON/IO_B.HDR_B88
DAU_TFT_CL2: sheet U_NB2_DBCON/IO_B.HDR_B90
DAU_TFT_CL3: sheet U_NB2_DBCON/IO_B.HDR_B92
DAU_TFT_DISP_ON: port TFT.DISP_ON, sheet U_NB2_DBCON/IO_B.HDR_B89  [project net DAU_TFT.DISP_ON]
DAU_TFT_GREEN0: sheet U_NB2_DBCON/IO_B.HDR_B72
DAU_TFT_GREEN1: sheet U_NB2_DBCON/IO_B.HDR_B74
DAU_TFT_GREEN2: sheet U_NB2_DBCON/IO_B.HDR_B76
DAU_TFT_GREEN3: sheet U_NB2_DBCON/IO_B.HDR_B78
DAU_TFT_GREEN4: sheet U_NB2_DBCON/IO_B.HDR_B80
DAU_TFT_GREEN5: sheet U_NB2_DBCON/IO_B.HDR_B82
DAU_TFT_IRQ: port TFT.IRQ, sheet U_NB2_DBCON/IO_B.HDR_B81  [project net DAU_TFT.IRQ]
DAU_TFT_M: port TFT.M, sheet U_NB2_DBCON/IO_B.HDR_B87  [project net DAU_TFT.M]
DAU_TFT_MUX: port TFT.MUX, sheet U_NB2_DBCON/IO_B.HDR_B85  [project net DAU_TFT.MUX]
DAU_TFT_POL: port TFT.POL, sheet U_NB2_DBCON/IO_B.HDR_B83  [project net DAU_TFT.POL]
DAU_TFT_RED0: sheet U_NB2_DBCON/IO_B.HDR_B52
DAU_TFT_RED1: sheet U_NB2_DBCON/IO_B.HDR_B54
DAU_TFT_RED2: sheet U_NB2_DBCON/IO_B.HDR_B56
DAU_TFT_RED3: sheet U_NB2_DBCON/IO_B.HDR_B58
DAU_TFT_RED4: sheet U_NB2_DBCON/IO_B.HDR_B60
DAU_TFT_STH: port TFT.STH, sheet U_NB2_DBCON/IO_B.HDR_B86  [project net DAU_TFT.STH]
DAU_TFT_STV: port TFT.STV, sheet U_NB2_DBCON/IO_B.HDR_B84  [project net DAU_TFT.STV]
DIP0: sheet U_NB2_DBCON/IN_ONLY.HDR_B22
DIP1: sheet U_NB2_DBCON/IN_ONLY.HDR_B24
DIP2: sheet U_NB2_DBCON/IN_ONLY.HDR_B26
DIP3: sheet U_NB2_DBCON/IN_ONLY.HDR_B28
DIP4: sheet U_NB2_DBCON/IN_ONLY.HDR_B30
DIP5: sheet U_NB2_DBCON/IN_ONLY.HDR_B32
DIP6: sheet U_NB2_DBCON/IN_ONLY.HDR_B34
DIP7: sheet U_NB2_DBCON/IN_ONLY.HDR_B36
EXTEND_A0: sheet U_NB2_DBCON/IO_L.HDR_L1
EXTEND_A1: sheet U_NB2_DBCON/IO_L.HDR_L3
EXTEND_A2: sheet U_NB2_DBCON/IO_L.HDR_L5
EXTEND_A3: sheet U_NB2_DBCON/IO_L.HDR_L7
EXTEND_A4: sheet U_NB2_DBCON/IO_L.HDR_L9
EXTEND_A5: sheet U_NB2_DBCON/IO_L.HDR_L11
EXTEND_A6: sheet U_NB2_DBCON/IO_L.HDR_L13
EXTEND_A7: sheet U_NB2_DBCON/IO_L.HDR_L15
EXTEND_A8: sheet U_NB2_DBCON/IO_L.HDR_L17
EXTEND_A9: sheet U_NB2_DBCON/IO_L.HDR_L19
EXTEND_A10: sheet U_NB2_DBCON/IO_L.HDR_L21
EXTEND_A11: sheet U_NB2_DBCON/IO_L.HDR_L23
EXTEND_A12: sheet U_NB2_DBCON/IO_L.HDR_L25
EXTEND_A13: sheet U_NB2_DBCON/IO_L.HDR_L27
EXTEND_A14: sheet U_NB2_DBCON/IO_L.HDR_L29
EXTEND_A15: sheet U_NB2_DBCON/IO_L.HDR_L31
EXTEND_A16: sheet U_NB2_DBCON/IO_L.HDR_L33
EXTEND_A17: sheet U_NB2_DBCON/IO_L.HDR_L35
EXTEND_A18: sheet U_NB2_DBCON/IO_L.HDR_L37
EXTEND_A19: sheet U_NB2_DBCON/IO_L.HDR_L39
EXTEND_A20: sheet U_NB2_DBCON/IO_L.HDR_L41
EXTEND_A21: sheet U_NB2_DBCON/IO_L.HDR_L43
EXTEND_A22: sheet U_NB2_DBCON/IO_L.HDR_L45
EXTEND_A23: sheet U_NB2_DBCON/IO_L.HDR_L47
EXTEND_A24: sheet U_NB2_DBCON/IO_L.HDR_L49
EXTEND_A25: sheet U_NB2_DBCON/IO_L.HDR_L51
EXTEND_A26: sheet U_NB2_DBCON/IO_L.HDR_L53
EXTEND_A27: sheet U_NB2_DBCON/IO_L.HDR_L55
EXTEND_A28: sheet U_NB2_DBCON/IO_L.HDR_L57
EXTEND_A29: sheet U_NB2_DBCON/IO_L.HDR_L59
EXTEND_A30: sheet U_NB2_DBCON/IO_L.HDR_L61
EXTEND_A31: sheet U_NB2_DBCON/IO_L.HDR_L63
EXTEND_A32: sheet U_NB2_DBCON/IO_L.HDR_L65
EXTEND_A33: sheet U_NB2_DBCON/IO_L.HDR_L67
EXTEND_A34: sheet U_NB2_DBCON/IO_L.HDR_L69
EXTEND_A35: sheet U_NB2_DBCON/IO_L.HDR_L71
EXTEND_A36: sheet U_NB2_DBCON/IO_L.HDR_L73
EXTEND_A37: sheet U_NB2_DBCON/IO_L.HDR_L75
EXTEND_A38: sheet U_NB2_DBCON/IO_L.HDR_L77
EXTEND_A39: sheet U_NB2_DBCON/IO_L.HDR_L79
EXTEND_A40: sheet U_NB2_DBCON/IO_L.HDR_L81
EXTEND_A41: sheet U_NB2_DBCON/IO_L.HDR_L83
EXTEND_A42: sheet U_NB2_DBCON/IO_L.HDR_L85
EXTEND_A43: sheet U_NB2_DBCON/IO_L.HDR_L87
EXTEND_A44: sheet U_NB2_DBCON/IO_L.HDR_L89
EXTEND_A45: sheet U_NB2_DBCON/IO_L.HDR_L91
EXTEND_A46: sheet U_NB2_DBCON/IO_L.HDR_L93
EXTEND_A47: sheet U_NB2_DBCON/IO_L.HDR_L95
EXTEND_A48: sheet U_NB2_DBCON/IO_L.HDR_L97
EXTEND_A49: sheet U_NB2_DBCON/IO_L.HDR_L99
EXTEND_B0: sheet U_NB2_DBCON/IO_L.HDR_L2
EXTEND_B1: sheet U_NB2_DBCON/IO_L.HDR_L4
EXTEND_B2: sheet U_NB2_DBCON/IO_L.HDR_L6
EXTEND_B3: sheet U_NB2_DBCON/IO_L.HDR_L8
EXTEND_B4: sheet U_NB2_DBCON/IO_L.HDR_L10
EXTEND_B5: sheet U_NB2_DBCON/IO_L.HDR_L12
EXTEND_B6: sheet U_NB2_DBCON/IO_L.HDR_L14
EXTEND_B7: sheet U_NB2_DBCON/IO_L.HDR_L16
EXTEND_B8: sheet U_NB2_DBCON/IO_L.HDR_L18
EXTEND_B9: sheet U_NB2_DBCON/IO_L.HDR_L20
EXTEND_B10: sheet U_NB2_DBCON/IO_L.HDR_L22
EXTEND_B11: sheet U_NB2_DBCON/IO_L.HDR_L24
EXTEND_B12: sheet U_NB2_DBCON/IO_L.HDR_L26
EXTEND_B13: sheet U_NB2_DBCON/IO_L.HDR_L28
EXTEND_B14: sheet U_NB2_DBCON/IO_L.HDR_L30
EXTEND_B15: sheet U_NB2_DBCON/IO_L.HDR_L32
EXTEND_B16: sheet U_NB2_DBCON/IO_L.HDR_L34
EXTEND_B17: sheet U_NB2_DBCON/IO_L.HDR_L36
EXTEND_B18: sheet U_NB2_DBCON/IO_L.HDR_L38
EXTEND_B19: sheet U_NB2_DBCON/IO_L.HDR_L40
EXTEND_B20: sheet U_NB2_DBCON/IO_L.HDR_L42
EXTEND_B21: sheet U_NB2_DBCON/IO_L.HDR_L44
EXTEND_B22: sheet U_NB2_DBCON/IO_L.HDR_L46
EXTEND_B23: sheet U_NB2_DBCON/IO_L.HDR_L48
EXTEND_B24: sheet U_NB2_DBCON/IO_L.HDR_L50
EXTEND_B25: sheet U_NB2_DBCON/IO_L.HDR_L52
EXTEND_B26: sheet U_NB2_DBCON/IO_L.HDR_L54
EXTEND_B27: sheet U_NB2_DBCON/IO_L.HDR_L56
EXTEND_B28: sheet U_NB2_DBCON/IO_L.HDR_L58
EXTEND_B29: sheet U_NB2_DBCON/IO_L.HDR_L60
EXTEND_B30: sheet U_NB2_DBCON/IO_L.HDR_L62
EXTEND_B31: sheet U_NB2_DBCON/IO_L.HDR_L64
EXTEND_B32: sheet U_NB2_DBCON/IO_L.HDR_L66
EXTEND_B33: sheet U_NB2_DBCON/IO_L.HDR_L68
EXTEND_B34: sheet U_NB2_DBCON/IO_L.HDR_L70
EXTEND_B35: sheet U_NB2_DBCON/IO_L.HDR_L72
EXTEND_B36: sheet U_NB2_DBCON/IO_L.HDR_L74
EXTEND_B37: sheet U_NB2_DBCON/IO_L.HDR_L76
EXTEND_B38: sheet U_NB2_DBCON/IO_L.HDR_L78
EXTEND_B39: sheet U_NB2_DBCON/IO_L.HDR_L80
EXTEND_B40: sheet U_NB2_DBCON/IO_L.HDR_L82
EXTEND_B41: sheet U_NB2_DBCON/IO_L.HDR_L84
EXTEND_B42: sheet U_NB2_DBCON/IO_L.HDR_L86
EXTEND_B43: sheet U_NB2_DBCON/IO_L.HDR_L88
EXTEND_B44: sheet U_NB2_DBCON/IO_L.HDR_L90
EXTEND_B45: sheet U_NB2_DBCON/IO_L.HDR_L92
EXTEND_B46: sheet U_NB2_DBCON/IO_L.HDR_L94
EXTEND_B47: sheet U_NB2_DBCON/IO_L.HDR_L96
EXTEND_B48: sheet U_NB2_DBCON/IO_L.HDR_L98
EXTEND_B49: sheet U_NB2_DBCON/IO_L.HDR_L100
EXTEND_C0: sheet U_NB2_DBCON/IO_T.HDR_T89
EXTEND_C1: sheet U_NB2_DBCON/IO_T.HDR_T87
EXTEND_C2: sheet U_NB2_DBCON/IO_T.HDR_T85
EXTEND_C3: sheet U_NB2_DBCON/IO_T.HDR_T83
EXTEND_C4: sheet U_NB2_DBCON/IO_T.HDR_T81
EXTEND_C5: sheet U_NB2_DBCON/IO_T.HDR_T79
EXTEND_C6: sheet U_NB2_DBCON/IO_T.HDR_T77
EXTEND_C7: sheet U_NB2_DBCON/IO_T.HDR_T75
EXTEND_C8: sheet U_NB2_DBCON/IO_T.HDR_T73
EXTEND_C9: sheet U_NB2_DBCON/IO_T.HDR_T71
EXTEND_C10: sheet U_NB2_DBCON/IO_T.HDR_T69
EXTEND_C11: sheet U_NB2_DBCON/IO_T.HDR_T67
EXTEND_C12: sheet U_NB2_DBCON/IO_T.HDR_T65
EXTEND_C13: sheet U_NB2_DBCON/IO_T.HDR_T63
EXTEND_C14: sheet U_NB2_DBCON/IO_T.HDR_T61
EXTEND_C15: sheet U_NB2_DBCON/IO_T.HDR_T59
EXTEND_C16: sheet U_NB2_DBCON/IO_T.HDR_T57
EXTEND_C17: sheet U_NB2_DBCON/IO_T.HDR_T55
EXTEND_C18: sheet U_NB2_DBCON/IO_T.HDR_T53
EXTEND_C19: sheet U_NB2_DBCON/IO_T.HDR_T51
EXTEND_C20: sheet U_NB2_DBCON/IO_T.HDR_T49
EXTEND_C21: sheet U_NB2_DBCON/IO_T.HDR_T47
EXTEND_C22: sheet U_NB2_DBCON/IO_T.HDR_T45
EXTEND_C23: sheet U_NB2_DBCON/IO_T.HDR_T43
EXTEND_C24: sheet U_NB2_DBCON/IO_T.HDR_T41
EXTEND_C25: sheet U_NB2_DBCON/IO_T.HDR_T39
EXTEND_C26: sheet U_NB2_DBCON/IO_T.HDR_T37
EXTEND_C27: sheet U_NB2_DBCON/IO_T.HDR_T35
EXTEND_C28: sheet U_NB2_DBCON/IO_T.HDR_T33
EXTEND_C29: sheet U_NB2_DBCON/IO_T.HDR_T31
EXTEND_C30: sheet U_NB2_DBCON/IO_T.HDR_T29
EXTEND_C31: sheet U_NB2_DBCON/IO_T.HDR_T27
EXTEND_C32: sheet U_NB2_DBCON/IO_T.HDR_T25
EXTEND_C33: sheet U_NB2_DBCON/IO_T.HDR_T23
EXTEND_C34: sheet U_NB2_DBCON/IO_T.HDR_T21
EXTEND_C35: sheet U_NB2_DBCON/IO_T.HDR_T19
EXTEND_C36: sheet U_NB2_DBCON/IO_T.HDR_T17
EXTEND_C37: sheet U_NB2_DBCON/IO_T.HDR_T15
EXTEND_C38: sheet U_NB2_DBCON/IO_T.HDR_T13
EXTEND_C39: sheet U_NB2_DBCON/IO_T.HDR_T11
EXTEND_C40: sheet U_NB2_DBCON/IO_T.HDR_T12
EXTEND_C41: sheet U_NB2_DBCON/IO_T.HDR_T9
EXTEND_C42: sheet U_NB2_DBCON/IO_T.HDR_T10
EXTEND_C43: sheet U_NB2_DBCON/IO_T.HDR_T7
EXTEND_C44: sheet U_NB2_DBCON/IO_T.HDR_T8
EXTEND_C45: sheet U_NB2_DBCON/IO_T.HDR_T5
EXTEND_C46: sheet U_NB2_DBCON/IO_T.HDR_T6
EXTEND_C47: sheet U_NB2_DBCON/IO_T.HDR_T3
EXTEND_C48: sheet U_NB2_DBCON/IO_T.HDR_T4
EXTEND_C49: sheet U_NB2_DBCON/IO_T.HDR_T2
FPGA_CCLK: port PROGRAM.CCLK, sheet U_NB2_DBCON/DB_FIXED.FPGA_CCLK  [project net DAU_PROG.CCLK]
FPGA_CLK: port CLOCKS.FPGA_CLK, sheet U_NB2_DBCON/DB_FIXED.FPGA_CLK  [project net CLKPLL.CLK_PROG]
FPGA_CLK1: port CLOCKS.FPGA_CLK1, sheet U_NB2_DBCON/DB_FIXED.FPGA_CLK1  [project net DAU_CLK.FPGA_CLK1]
FPGA_DIN: port PROGRAM.DIN, sheet U_NB2_DBCON/DB_FIXED.FPGA_DIN  [project net DAU_PROG.DIN]
FPGA_DONE: port PROGRAM.DONE, sheet U_NB2_DBCON/DB_FIXED.FPGA_DONE  [project net DAU_PROG.DONE]
FPGA_INIT: port PROGRAM.INIT, sheet U_NB2_DBCON/DB_FIXED.FPGA_INIT  [project net DAU_PROG.INIT]
FPGA_INSTALLED: port PROGRAM.INSTALLED, sheet U_NB2_DBCON/DB_FIXED.FPGA_INSTALLED  [project net DAU_PROG.INSTALLED]
FPGA_PROG_CLK: port PROGRAM.PROG_CLK, sheet U_NB2_DBCON/DB_FIXED.FPGA_PROG_CLK  [project net DAU_PROG.PROG_CLK]
FPGA_PROG_PWR_ON: port PROGRAM.PROG_PWR_ON, sheet U_NB2_DBCON/DB_FIXED.FPGA_PROG_PWR_ON  [project net DAU_PROG.PROG_PWR_ON]
FPGA_PROGRAM: port PROGRAM.PROGRAM, sheet U_NB2_DBCON/DB_FIXED.FPGA_PROGRAM  [project net DAU_PROG.PROGRAM]
FPGA_TCK: harness JTAG.TCK, sheet U_NB2_DBCON/DB_FIXED.FPGA_TCK
FPGA_TDI: harness JTAG.TDI, sheet U_NB2_DBCON/DB_FIXED.FPGA_TDI
FPGA_TDO: harness JTAG.TDO, sheet U_NB2_DBCON/DB_FIXED.FPGA_TDO
FPGA_TMS: harness JTAG.TMS, sheet U_NB2_DBCON/DB_FIXED.FPGA_TMS
IO0: sheet U_NB2_DBCON/IO_B.HDR_B7
IO1: sheet U_NB2_DBCON/IO_B.HDR_B9
IO2: sheet U_NB2_DBCON/IO_B.HDR_B11
IO3: sheet U_NB2_DBCON/IO_B.HDR_B13
IO4: sheet U_NB2_DBCON/IO_B.HDR_B15
IO5: sheet U_NB2_DBCON/IO_B.HDR_B17
IO6: sheet U_NB2_DBCON/IO_B.HDR_B19
IO7: sheet U_NB2_DBCON/IO_B.HDR_B21
IO8: sheet U_NB2_DBCON/IO_B.HDR_B23
IO9: sheet U_NB2_DBCON/IO_B.HDR_B25
IO10: sheet U_NB2_DBCON/IO_B.HDR_B27
IO11: sheet U_NB2_DBCON/IO_B.HDR_B29
IO12: sheet U_NB2_DBCON/IO_B.HDR_B31
IO13: sheet U_NB2_DBCON/IO_B.HDR_B33
IO14: sheet U_NB2_DBCON/IO_B.HDR_B35
IO15: sheet U_NB2_DBCON/IO_B.HDR_B37
IO16: sheet U_NB2_DBCON/IO_B.HDR_B39
IO17: sheet U_NB2_DBCON/IO_B.HDR_B41
IO18: sheet U_NB2_DBCON/IO_B.HDR_B43
IO19: sheet U_NB2_DBCON/IO_B.HDR_B45
IO20: sheet U_NB2_DBCON/IO_B.HDR_B47
IO21: sheet U_NB2_DBCON/IO_B.HDR_B49
IO22: sheet U_NB2_DBCON/IO_B.HDR_B51
IO23: sheet U_NB2_DBCON/IO_B.HDR_B53
IO24: sheet U_NB2_DBCON/IO_B.HDR_B55
IO25: sheet U_NB2_DBCON/IO_B.HDR_B57
IO26: sheet U_NB2_DBCON/IO_B.HDR_B59
IO27: sheet U_NB2_DBCON/IO_B.HDR_B61
IO28: sheet U_NB2_DBCON/IO_B.HDR_B63
IO29: sheet U_NB2_DBCON/IO_B.HDR_B65
IO30: sheet U_NB2_DBCON/IO_B.HDR_B67
IO31: sheet U_NB2_DBCON/IO_B.HDR_B69
IO32: sheet U_NB2_DBCON/IO_B.HDR_B71
IO33: sheet U_NB2_DBCON/IO_B.HDR_B73
IO34: sheet U_NB2_DBCON/IO_B.HDR_B75
IO35: sheet U_NB2_DBCON/IO_B.HDR_B77
KBCLOCK: port KEYBOARD.CLOCK, sheet U_NB2_DBCON/IO_T.HDR_T26  [project net KEYBOARD.CLOCK]
KBDATA: port KEYBOARD.DATA, sheet U_NB2_DBCON/IO_T.HDR_T28  [project net KEYBOARD.DATA]
MOUSECLOCK: port MOUSE.CLOCK, sheet U_NB2_DBCON/IO_T.HDR_T30  [project net MOUSE.CLOCK]
MOUSEDATA: port MOUSE.DATA, sheet U_NB2_DBCON/IO_T.HDR_T32  [project net MOUSE.DATA]
NEXUS_TCK: harness JTAG.TCK, sheet U_NB2_DBCON/DB_FIXED.NEXUS_TCK
NEXUS_TDI: harness JTAG.TDI, sheet U_NB2_DBCON/DB_FIXED.NEXUS_TDI
NEXUS_TDO: harness JTAG.TDO, sheet U_NB2_DBCON/DB_FIXED.NEXUS_TDO
NEXUS_TMS: harness JTAG.TMS, sheet U_NB2_DBCON/DB_FIXED.NEXUS_TMS
ONE_WIRE_DB_PB: port ONE_WIRE_DB_PB, sheet U_NB2_DBCON/IO_B.HDR_B79  [project net 1W_DBPB]
ONE_WIRE_DBID: port ONE_WIRE_DBID, sheet U_NB2_DBCON/DB_FIXED.ONE_WIRE_DBID  [project net 1W_DBID]
REF_CLK: port CLOCKS.REF_CLK, sheet U_NB2_DBCON/DB_FIXED.REF_CLK  [project net CLKPLL.CLK_FIXED]
RS232_CTS: port RS232.CTS, sheet U_NB2_DBCON/IO_T.HDR_T22  [project net RS232.CTS]
RS232_RTS: port RS232.RTS, sheet U_NB2_DBCON/IO_T.HDR_T18  [project net RS232.RTS]
RS232_RX: port RS232.RXD, sheet U_NB2_DBCON/IO_T.HDR_T24  [project net RS232.RXD]
RS232_TX: port RS232.TXD, sheet U_NB2_DBCON/IO_T.HDR_T20  [project net RS232.TXD]
SCL: port I2C.SCL, sheet U_NB2_DBCON/IO_B.HDR_B5  [project net I2C.SCL]
SDA: port I2C.SDA, sheet U_NB2_DBCON/IO_B.HDR_B3  [project net I2C.SDA]
USER_LED0: sheet U_NB2_DBCON/IO_B.HDR_B6
USER_LED1: sheet U_NB2_DBCON/IO_B.HDR_B8
USER_LED2: sheet U_NB2_DBCON/IO_B.HDR_B10
USER_LED3: sheet U_NB2_DBCON/IO_B.HDR_B12
USER_LED4: sheet U_NB2_DBCON/IO_B.HDR_B14
USER_LED5: sheet U_NB2_DBCON/IO_B.HDR_B16
USER_LED6: sheet U_NB2_DBCON/IO_B.HDR_B18
USER_LED7: sheet U_NB2_DBCON/IO_B.HDR_B20
VCCX_REF: port VCCX_REF, sheet U_NB2_DBCON/DB_FIXED.VCCX_REF

### Buses and harness runs
bus DAU_TFT_BLUE[4..0]
bus DAU_TFT_CL[3..1]
bus DAU_TFT_GREEN[5..0]
bus DAU_TFT_RED[4..0]
bus DIP[7..0]
bus EXTEND_A[49..0]
bus EXTEND_B[49..0]
bus EXTEND_C[49..0]
bus FPGA_ID[3..0]
bus FPGA_M[2..0]
bus IO[35..0]
bus SW[4..0]
bus USER_LED[7..0]
harness port DBPOWER = sheet U_NB2_DBCON/DBPOWER

## Nets that join several sheets
1V2: XC3S1500-4FG676C_PWRSETUP (20 pins), CURRENT_SENSE (7 pins)
2V5: FPGA_PRGSETUP (R1.1 R4.1 R5_S3.1), XC3S1500-4FG676C_PWRSETUP (16 pins), CURRENT_SENSE (7 pins)
3V3: NB2_PSU (C23_CM.1 C24_CM.1), FPGA_PRGSETUP (R7_S3.1), XC3S1500-4FG676C_PWRSETUP (64 pins), CURRENT_SENSE (13 pins)
5V0: NB2_PSU (C1.1 C2.1 C3.1 C4.1), PWJACK+SWITCH (J1OUT.1 SW8.1 SW8.2 TP2#1.1), CURRENT_SENSE (9 pins)
GND: NB2_PSU (16 pins), PWJACK+SWITCH (6 pins), FPGA_PRGSETUP (U1#1.AC3 U1#1.AE3 U1#1.AF3 U1#1.C2), XC3S1500-4FG676C_PWRSETUP (76 pins), CURRENT_SENSE (5 pins)
5VUSW: NB2_PSU (D1.2), PWJACK+SWITCH (F1.2 SW8.3)
CSSPI_CS1: Host_FPGA (U1#1.C12), CURRENT_SENSE (U14.17)
CSSPI_CS2: Host_FPGA (U1#1.AC7), CURRENT_SENSE (U13.17)
CSSPI_DIN: Host_FPGA (U1#1.U4), CURRENT_SENSE (U14.18)
CSSPI_DIN2: Host_FPGA (U1#1.AD15), CURRENT_SENSE (U13.18)
CSSPI_DOUT: Host_FPGA (U1#1.W5), CURRENT_SENSE (U14.19)
CSSPI_DOUT2: Host_FPGA (U1#1.AD18), CURRENT_SENSE (U13.19)
CSSPI_EOC1: Host_FPGA (U1#1.D11), CURRENT_SENSE (U14.20)
CSSPI_EOC2: Host_FPGA (U1#1.AC8), CURRENT_SENSE (U13.20)
CSSPI_SCLK: Host_FPGA (U1#1.T4), CURRENT_SENSE (U14.16)
CSSPI_SCLK2: Host_FPGA (U1#1.AB13), CURRENT_SENSE (U13.16)